# Altium schematic sheet B0621_T01_V1.0.SchDoc
size A2
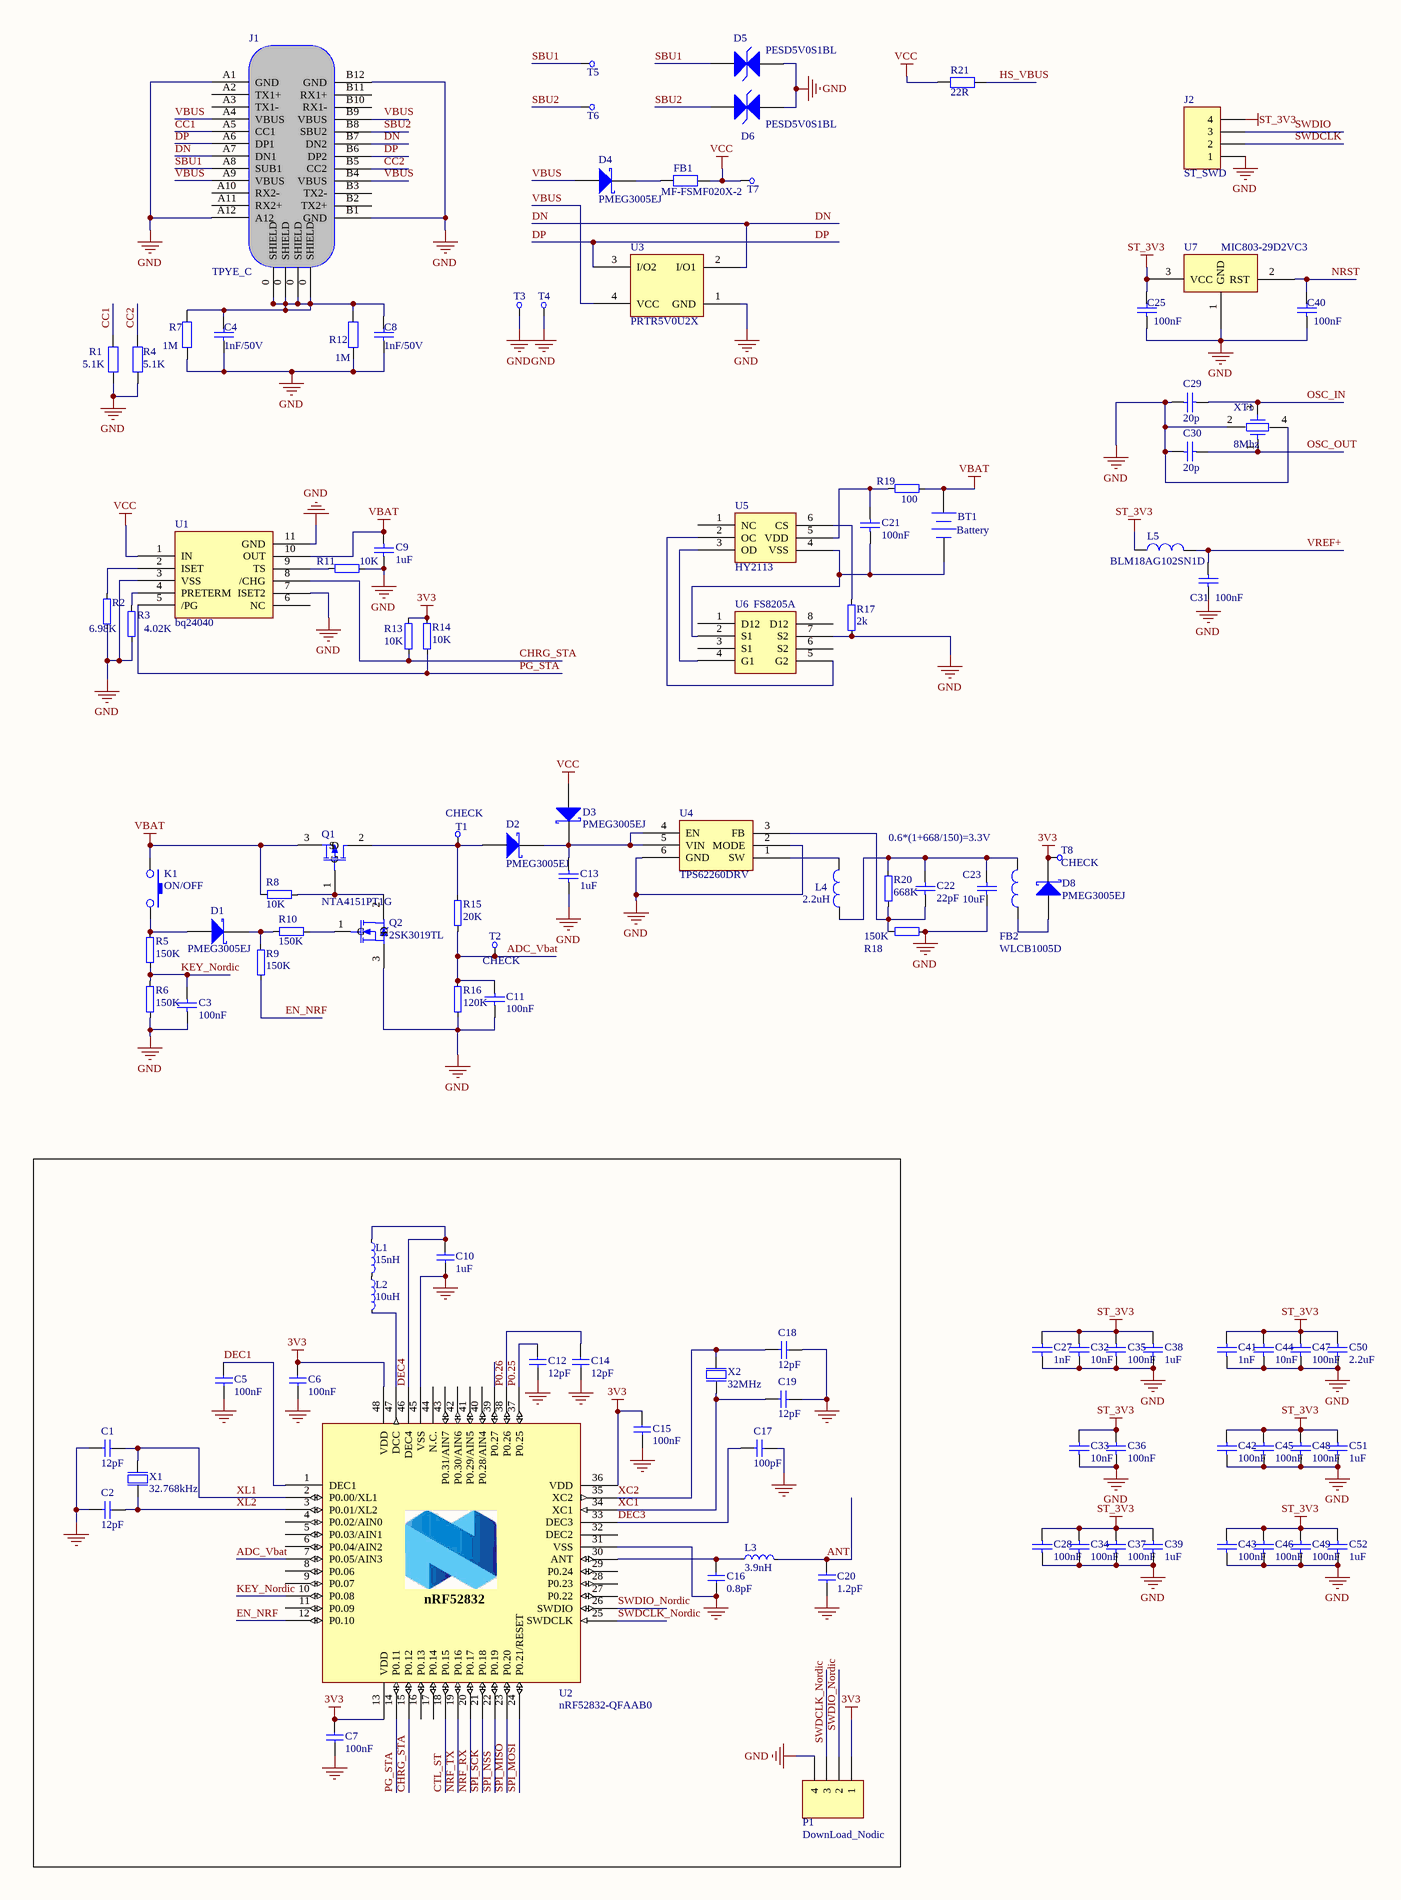
[diagram p0: B0621_T01_V1.0.SchDoc, left]
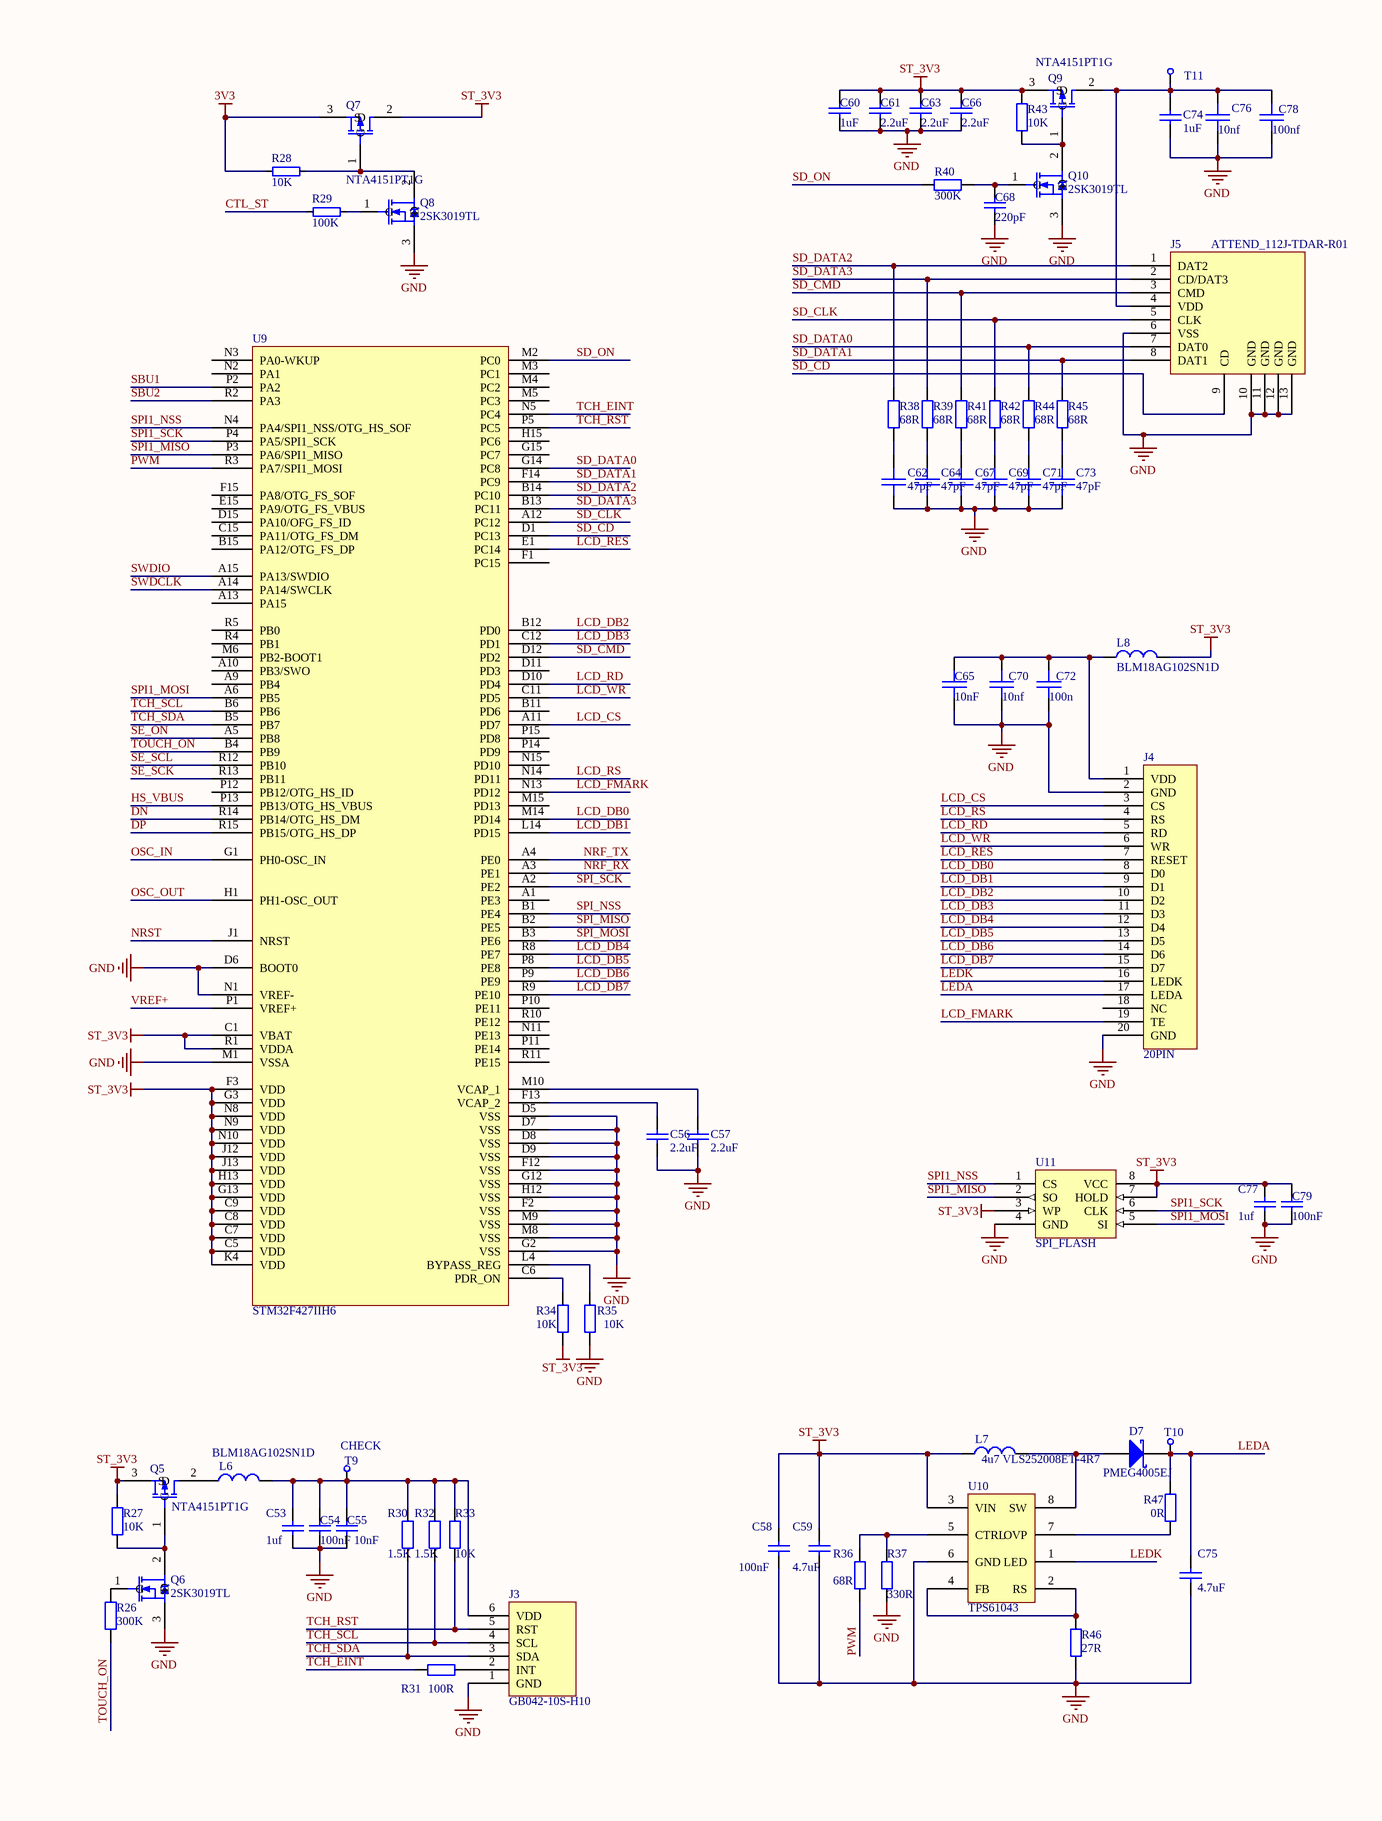
[diagram p1: B0621_T01_V1.0.SchDoc, right]

## Parts
BT1  Battery  [BAT_CON]
C1  12pF  [0402-c]
C2  12pF  [0402-c]
C3  100nF  [0402-c]
C4  1nF/50V  [0402-c]
C5  100nF  [0402-c]
C6  100nF  [0402-c]
C7  100nF  [0402-c]
C8  1nF/50V  [0402-c]
C9  1uF  [0402-c]
C10  1uF  [0402-c]
C11  100nF  [0402-c]
C12  12pF  [0402-c]
C13  1uF  [0402-c]
C14  12pF  [0402-c]
C15  100nF  [0402-c]
C16  0.8pF  [0402-c]
C17  100pF  [0402-c]
C18  12pF  [0402-c]
C19  12pF  [0402-c]
C20  1.2pF  [0402-c]
C21  100nF  [0402-c]
C22  22pF  [0402-c]
C23  10uF  [0402-C1]
C25  100nF  [0402-c]
C27  1nF  [0402-c]
C28  100nF  [0402-c]
C29  20p  [0402-c]
C30  20p  [0402-C]
C31  value 100nF  [0402-c]  (hidden comment: 100n)
C32  10nF  [0402-c]
C33  10nF  [0402-c]
C34  100nF  [0402-c]
C35  100nF  [0402-c]
C36  100nF  [0402-c]
C37  100nF  [0402-c]
C38  1uF  [0402-c]
C39  1uF  [0402-c]
C40  100nF  [0402-c]
C41  1nF  [0402-c]
C42  100nF  [0402-c]
C43  100nF  [0402-c]
C44  10nF  [0402-c]
C45  100nF  [0402-c]
C46  100nF  [0402-c]
C47  100nF  [0402-c]
C48  100nF  [0402-c]
C49  100nF  [0402-c]
C50  2.2uF  [0402-c]
C51  1uF  [0402-c]
C52  1uF  [0402-c]
C53  1uf  [0402-c]
C54  value 100nF  [0402-c]  (hidden comment: 1n)
C55  value 10nF  [0402-c]  (hidden comment: 1n)
C56  2.2uF  [0402-c]
C57  2.2uF  [0402-c]
C58  100nF  [0402-c]
C59  4.7uF  [0402-c]
C60  1uF  [0402-c]
C61  2.2uf  [0402-c]
C62  47pF  [0402-c]
C63  2.2uf  [0402-c]
C64  47pF  [0402-c]
C65  10nF  [0402-C]
C66  2.2uf  [0402-c]
C67  47pF  [0402-C]
C68  220pF  [0402-c]
C69  47pF  [0402-c]
C70  10nf  [0402-c]
C71  47pF  [0402-C]
C72  100n  [0402-c]
C73  47pF  [0402-C]
C74  1uF  [0402-c]
C75  4.7uF  [0402-c]
C76  10nf  [0402-c]
C77  1uf  [0402-c]
C78  100nf  [0402-c]
C79  value 100nF  [0402-c]  (hidden comment: 1n)
D1  PMEG3005EJ  [SOD323]
D2  PMEG3005EJ  [SOD323]
D3  PMEG3005EJ  [SOD323]
D4  PMEG3005EJ  [SOD323]
D5  PESD5V0S1BL  [SOD882]
D6  PESD5V0S1BL  [SOD882]
D7  PMEG4005EJ  [SOD323]
D8  PMEG3005EJ  [SOD323]
FB1  MF-FSMF020X-2  [0603-1]
FB2  WLCB1005D  [0603-1]
J1  TPYE_C  [TYPEC1]
J2  ST_SWD  [SWD_CON]
J3  GB042-10S-H10  [6PIN-1]
J4  20PIN  [20PIN-1]
J5  ATTEND_112J-TDAR-R01  [TF_1]
K1  ON/OFF  [switch_con]
L1  15nH  [INDC1005X04L]
L2  10uH  [INDC1005X04L]
L3  3.9nH  [INDC1005X04L]
L4  2.2uH  [0603-1]
L5  BLM18AG102SN1D  [0603-1]
L6  BLM18AG102SN1D  [0603-1]
L7  4u7 VLS252008ET-4R7  [L_2.5X2.0]
L8  BLM18AG102SN1D  [0603-1]
P1  DownLoad_Nodic  [SWD_CON]
Q1  NTA4151PT1G  [SOT523_MOSFET]
Q2  2SK3019TL  [SOT523_MOSFET]
Q5  NTA4151PT1G  [SOT523_MOSFET]
Q6  2SK3019TL  [SOT523_MOSFET]
Q7  NTA4151PT1G  [SOT523_MOSFET]
Q8  2SK3019TL  [SOT523_MOSFET]
Q9  NTA4151PT1G  [SOT523_MOSFET]
Q10  2SK3019TL  [SOT523_MOSFET]
R1  5.1K  [0402-a]
R2  6.98K  [0402-A]
R3  4.02K  [0402-A]
R4  5.1K  [0402-a]
R5  150K  [0402-A]
R6  150K  [0402-A]
R7  1M  [0402-a]
R8  10K  [0402-A]
R9  150K  [0402-A]
R10  150K  [0402-A]
R11  10K  [0402-A]
R12  1M  [0402-a]
R13  10K  [0402-A]
R14  10K  [0402-A]
R15  20K  [0402-A]
R16  120K  [0402-A]
R17  2k  [0402-A]
R18  150K  [0402-A]
R19  100  [0402-A]
R20  668K  [0402-A]
R21  22R  [0402-a]
R26  300K  [0402-A]
R27  10K  [0402-A]
R28  10K  [0402-A]
R29  100K  [0402-A]
R30  1.5K  [0402-A]
R31  100R  [0402-A]
R32  1.5K  [0402-A]
R33  10K  [0402-A]
R34  10K  [0402-A]
R35  10K  [0402-A]
R36  68R  [0402-a]
R37  330R  [0402-a]
R38  68R  [0402-A]
R39  68R  [0402-A]
R40  300K  [0402-A]
R41  68R  [0402-A]
R42  68R  [0402-A]
R43  10K  [0402-A]
R44  68R  [0402-A]
R45  68R  [0402-A]
R46  27R  [0402-a]
R47  0R  [0402-a]
T1  CHECK  [CHECK-B]
T2  CHECK  [CHECK-B]
T3  CHECK  [CHECK-B]  (value not drawn)
T4  CHECK  [CHECK-B]  (value not drawn)
T5  CHECK  [CHECK-B]  (value not drawn)
T6  CHECK  [CHECK-B]  (value not drawn)
T7  CHECK  [CHECK-B]  (value not drawn)
T8  CHECK  [CHECK-B]
T9  CHECK  [CHECK-B]
T10  CHECK  [CHECK-B]  (value not drawn)
T11  CHECK  [CHECK-B]  (value not drawn)
U1  bq24040  [WSON-10]
U2  nRF52832-QFAAB0  [2-QFN40P600X600X90-48N]
U3  PRTR5V0U2X  [SOT143B]
U4  TPS62260DRV  [SON-6]
U5  HY2113  [DFN-6L]
U6  FS8205A  [TSSOP-8]
U7  MIC803-29D2VC3  [SC70-3]
U9  STM32F427IIH6  [UFBGA176+25]
U10  TPS61043  [QFN-8]
U11  SPI_FLASH  [WSON-8]
X1  32.768kHz  [XTAL_3215]
X2  32MHz  [BT-XTAL_2016]
XT1  8Mhz  [OSC_4-3225]

## Nets
3V3: C6.2 C7.2 C15.2 D8.2(K) P1.1 Q7.3(S) R13.1 R14.1 R28.2 T8.1 U2.13(VDD) U2.36(VDD) U2.48(VDD)
GND: C1.2 C2.2 C3.1 C4.1 C5.1 C6.1 C7.1 C8.1 C9.1 C10.1 C11.1 C12.1 C13.1 C14.1 C15.1 C16.2 C17.1 C18.1 C19.2 C20.1 C23.2 C25.1 C27.2 C28.2 C29.2 C30.2 C31.1 C32.2 C33.2 C34.2 C35.2 C36.2 C37.2 C38.2 C39.2 C40.1 C41.2 C42.2 C43.2 C44.2 C45.2 C46.2 C47.2 C48.2 C49.2 C50.2 C51.2 C52.2 C53.1 C54.1 C55.1 C56.2 C57.2 C58.1 C59.1 C60.1 C61.1 C62.1 C63.1 C64.1 C65.2 C66.1 C67.1 C68.1 C69.1 C70.2 C71.1 C72.2 C73.1 C74.2 C75.1 C76.2 C77.1 C78.2 C79.1 D5.1(A) D6.1(A) J1.A1(GND) J1.A12 J1.B1(GND) J1.B12(GND) J2.1 J3.1(GND) J3.7 J3.8 J4.2(GND) J4.20(GND) J4.21 J4.22 J5.6(VSS) J5.10(GND) J5.11(GND) J5.12(GND) J5.13(GND) P1.4 Q2.3(S) Q6.3(S) Q8.3(S) Q10.3(S) R1.1 R2.1 R3.1 R4.1 R6.1 R7.1 R11.1 R12.1 R16.1 R17.2 R18.1 R35.1 R37.1 R46.1 T3.1 T4.1 U1.3(VSS) U1.7(ISET2) U1.11(GND) U2.31(VSS) U2.45(VSS) U2.49(GND) U3.1(GND) U4.2(MODE) U4.6(GND) U6.7(S2) U7.1(GND) U9.D5(VSS) U9.D6(BOOT0) U9.D7(VSS) U9.D8(VSS) U9.D9(VSS) U9.F2(VSS) U9.F6(GND) U9.F7(GND) U9.F8(GND) U9.F9(GND) U9.F10(GND) U9.F12(VSS) U9.G2(VSS) U9.G6(GND) U9.G7(GND) U9.G8(GND) U9.G9(GND) U9.G10(GND) U9.G12(VSS) U9.H6(GND) U9.H7(GND) U9.H8(GND) U9.H9(GND) U9.H10(GND) U9.H12(VSS) U9.J6(GND) U9.J7(GND) U9.J8(GND) U9.J9(GND) U9.J10(GND) U9.K6(GND) U9.K7(GND) U9.K8(GND) U9.K9(GND) U9.K10(GND) U9.M1(VSSA) U9.M8(VSS) U9.M9(VSS) U9.N1(VREF-) U10.6(GND) U10.9(GND) U11.4(GND) U11.9(GND) X2.2(GND) X2.4(GND) XT1.2 XT1.4
ST_3V3: C25.2 C27.1 C28.1 C32.1 C33.1 C34.1 C35.1 C36.1 C37.1 C38.1 C39.1 C41.1 C42.1 C43.1 C44.1 C45.1 C46.1 C47.1 C48.1 C49.1 C50.1 C51.1 C52.1 C58.2 C59.2 C60.2 C61.2 C63.2 C66.2 C77.2 C79.2 J2.4 L5.1 L7.1 L8.2 Q5.3(S) Q7.2(D) Q9.3(S) R27.2 R34.1 R43.2 U7.3(VCC) U9.C1(VBAT) U9.C5(VDD) U9.C7(VDD) U9.C8(VDD) U9.C9(VDD) U9.F3(VDD) U9.G3(VDD) U9.G13(VDD) U9.H13(VDD) U9.J12(VDD) U9.J13(VDD) U9.K4(VDD) U9.N8(VDD) U9.N9(VDD) U9.N10(VDD) U9.R1(VDDA) U10.3(VIN) U11.3(WP) U11.7(HOLD) U11.8(VCC)
VBAT: BT1.1(+) C9.2 K1.1 Q1.3(S) R8.2 R19.2 U1.10(OUT)
VCC: D3.1(A) FB1.2 R21.1 T7.1 U1.1(IN)
ADC_Vbat: C11.2 R15.2 R16.2 T2.1 U2.7(P0.05/AIN3)
ANT: C20.2 L3.2
CC1: J1.A5(CC1) R1.2
CC2: J1.B5(CC2) R4.2
CHRG_STA: R13.2 U1.8(/CHG) U2.15(P0.12)
CTL_ST: R29.2 U2.18(P0.15)
DEC1: C5.2 U2.1(DEC1)
DEC3: C17.2 U2.33(DEC3)
DEC4: C10.2 L1.1 U2.46(DEC4)
DN: J1.A7(DN1) J1.B7(DN2) U3.2(I/O1) U9.R14(PB14/OTG_HS_DM)
DP: J1.A6(DP1) J1.B6(DP2) U3.3(I/O2) U9.R15(PB15/OTG_HS_DP)
EN_NRF: R9.1 U2.12(P0.10)
HS_VBUS: R21.2 U9.P13(PB13/OTG_HS_VBUS)
KEY_Nordic: C3.2 R5.1 R6.2 U2.10(P0.08)
LCD_CS: J4.3(CS) U9.A11(PD7)
LCD_DB0: J4.8(D0) U9.M14(PD14)
LCD_DB1: J4.9(D1) U9.L14(PD15)
LCD_DB2: J4.10(D2) U9.B12(PD0)
LCD_DB3: J4.11(D3) U9.C12(PD1)
LCD_DB4: J4.12(D4) U9.R8(PE7)
LCD_DB5: J4.13(D5) U9.P8(PE8)
LCD_DB6: J4.14(D6) U9.P9(PE9)
LCD_DB7: J4.15(D7) U9.R9(PE10)
LCD_FMARK: J4.19(TE) U9.N13(PD12)
LCD_RD: J4.5(RD) U9.D10(PD4)
LCD_RES: J4.7(RESET) U9.E1(PC14)
LCD_RS: J4.4(RS) U9.N14(PD11)
LCD_WR: J4.6(WR) U9.C11(PD5)
LEDA: C75.2 D7.2(K) J4.17(LEDA) R47.2 T10.1
LEDK: J4.16(LEDK) U10.1(LED)
NRF_RX: U2.20(P0.17) U9.A3(PE1)
NRF_TX: U2.19(P0.16) U9.A4(PE0)
NRST: C40.2 U7.2(RST) U9.J1(NRST)
OSC_IN: C29.1 U9.G1(PH0-OSC_IN) XT1.3
OSC_OUT: C30.1 U9.H1(PH1-OSC_OUT) XT1.1
P0.25: C12.2 U2.37(P0.25)
P0.26: C14.2 U2.38(P0.26)
PG_STA: R14.2 U1.5(/PG) U2.14(P0.11)
PWM: R36.1 U9.R3(PA7/SPI1_MOSI)
SBU1: D5.2(K) J1.A8(SUB1) T5.1 U9.P2(PA2)
SBU2: D6.2(K) J1.B8(SBU2) T6.1 U9.R2(PA3)
SD_CD: J5.9(CD) U9.D1(PC13)
SD_CLK: J5.5(CLK) R42.1 U9.A12(PC12)
SD_CMD: J5.3(CMD) R41.1 U9.D12(PD2)
SD_DATA0: J5.7(DAT0) R44.1 U9.G14(PC8)
SD_DATA1: J5.8(DAT1) R45.1 U9.F14(PC9)
SD_DATA2: J5.1(DAT2) R38.1 U9.B14(PC10)
SD_DATA3: J5.2(CD/DAT3) R39.1 U9.B13(PC11)
SD_ON: R40.1 U9.M2(PC0)
SE_ON: U9.A5(PB8)
SE_SCK: U9.R13(PB11)
SE_SCL: U9.R12(PB10)
SPI1_MISO: U9.P3(PA6/SPI1_MISO) U11.2(SO)
SPI1_MOSI: U9.A6(PB5) U11.5(SI)
SPI1_NSS: U9.N4(PA4/SPI1_NSS/OTG_HS_SOF) U11.1(CS)
SPI1_SCK: U9.P4(PA5/SPI1_SCK) U11.6(CLK)
SPI_MISO: U2.23(P0.20) U9.B2(PE5)
SPI_MOSI: U2.24(P0.21/RESET) U9.B3(PE6)
SPI_NSS: U2.22(P0.19) U9.B1(PE4)
SPI_SCK: U2.21(P0.18) U9.A2(PE2)
SWDCLK: J2.2 U9.A14(PA14/SWCLK)
SWDCLK_Nordic: P1.3 U2.25(SWDCLK)
SWDIO: J2.3 U9.A15(PA13/SWDIO)
SWDIO_Nordic: P1.2 U2.26(SWDIO)
TCH_EINT: R31.2 U9.N5(PC4)
TCH_RST: J3.5(RST) R33.1 U9.P5(PC5)
TCH_SCL: J3.4(SCL) R32.1 U9.B6(PB6)
TCH_SDA: J3.3(SDA) R30.1 U9.B5(PB7)
TOUCH_ON: R26.1 U9.B4(PB9)
VBUS: D4.1(A) J1.A4(VBUS) J1.A9(VBUS) J1.B4(VBUS) J1.B9(VBUS) U3.4(VCC)
VREF+: C31.2 L5.2 U9.P1(VREF+)
XC1: C19.1 U2.34(XC1) X2.1(inp)
XC2: C18.2 U2.35(XC2) X2.3(out)
XL1: C1.1 U2.2(P0.00/XL1) X1.1(inp)
XL2: C2.1 U2.3(P0.01/XL2) X1.2(out)
NetBT1_2: BT1.2(-) C21.1 U5.4(VSS) U6.2(S1)
NetC4_2: C4.2 C8.2 J1.0(SHIELD) R7.2 R12.2
NetC13_2: C13.2 D2.2(K) D3.2(K) U4.4(EN) U4.5(VIN)
NetC16_1: C16.1 L3.1 U2.30(ANT)
NetC21_2: C21.2 R19.1 U5.5(VDD)
NetC22_1: C22.1 C23.1 FB2.2 L4.1 R20.1
NetC22_2: C22.2 R18.2 R20.2 U4.3(FB)
NetC53_2: C53.2 C54.2 C55.2 J3.6(VDD) L6.2 R30.2 R32.2 R33.2 T9.1
NetC56_1: C56.1 U9.F13(VCAP_2)
NetC57_1: C57.1 U9.M10(VCAP_1)
NetC62_2: C62.2 R38.2
NetC64_2: C64.2 R39.2
NetC65_1: C65.1 C70.1 C72.1 J4.1(VDD) L8.1
NetC67_2: C67.2 R41.2
NetC68_2: C68.2 Q10.1(G) R40.2
NetC69_2: C69.2 R42.2
NetC71_2: C71.2 R44.2
NetC73_2: C73.2 R45.2
NetC74_1: C74.1 C76.1 C78.1 J5.4(VDD) Q9.2(D) T11.1
NetD1_1: D1.1(A) K1.2 R5.2
NetD1_2: D1.2(K) R9.2 R10.2
NetD2_1: D2.1(A) Q1.2(D) R15.1 T1.1
NetD4_2: D4.2(K) FB1.1
NetD7_1: D7.1(A) L7.2 U10.8(SW)
NetD8_1: D8.1(A) FB2.1
NetJ3_2: J3.2(INT) R31.1
NetL1_2: L1.2 L2.1
NetL2_2: L2.2 U2.47(DCC)
NetL4_2: L4.2 U4.1(SW)
NetL6_1: L6.1 Q5.2(D)
NetQ1_1: Q1.1(G) Q2.2(D) R8.1
NetQ2_1: Q2.1(G) R10.1
NetQ5_1: Q5.1(G) Q6.2(D) R27.1
NetQ6_1: Q6.1(G) R26.2
NetQ7_1: Q7.1(G) Q8.2(D) R28.1
NetQ8_1: Q8.1(G) R29.1
NetQ9_1: Q9.1(G) Q10.2(D) R43.1
NetR2_2: R2.2 U1.2(ISET)
NetR3_2: R3.2 U1.4(PRETERM)
NetR11_2: R11.2 U1.9(TS)
NetR17_1: R17.1 U5.6(CS)
NetR34_2: R34.2 U9.C6(PDR_ON)
NetR35_2: R35.2 U9.L4(BYPASS_REG)
NetR36_2: R36.2 R37.2 U10.5(CTRL)
NetR46_2: R46.2 U10.2(RS) U10.4(FB)
NetR47_1: R47.1 U10.7(OVP)
NetU5_2: U5.2(OC) U6.5(G2)
NetU5_3: U5.3(OD) U6.4(G1)

Not connected (* = marked no-connect by the designer): J1 A2(TX1+) A3(TX1-) A10(RX2-) A11(RX2+) B2(TX2+) B3(TX2-) B10(RX1-) B11(RX1+); J4 18(NC); U1 6(NC); U2 4(P0.02/AIN0) 5(P0.03/AIN1) 6(P0.04/AIN2) 8(P0.06) 9(P0.07) 11(P0.09) 16(P0.13) 17(P0.14) 27(P0.22) 28(P0.23) 29(P0.24) 32(DEC2) 39(P0.27) 40(P0.28/AIN4) 41(P0.29/AIN5) 42(P0.30/AIN6) 43(P0.31/AIN7) 44(N.C.); U5 1(NC); U6 1(D12) 3(S1) 6(S2) 8(D12); U9 A1(PE3) A7(PG14) A8(PG13) A9(PB4) A10(PB3/SWO) A13(PA15) B7(PG15) B8(PG12) B9(PG11) B10(PG10) B11(PD6) B15(PA12/OTG_FS_DP) C2(PI7) C3(PI6) C4(PI5) C10(PG9) C13(PI3) C14(PI2) C15(PA11/OTG_FS_DM) D2(PI8) D3(PI9) D4(PI4) D11(PD3) D13(PH15) D14(PI1) D15(PA10/OFG_FS_ID) E2(PF0) E3(PI10) E4(PI11) E12(PH13) E13(PH14) E14(PI0) E15(PA9/OTG_FS_VBUS) F1(PC15) F4(PH2) F15(PA8/OTG_FS_SOF) G4(PH3) G15(PC7) H2(PF2) H3(PF1) H4(PH4) H14(PG8) H15(PC6) J2(PF3) J3(PF4) J4(PH5) J14(PG7) J15(PG6) K1(PF7) K2(PF6) K3(PF5) K12(PH12) K13(PG5) K14(PG4) K15(PG3) L1(PF10) L2(PF9) L3(PF8) L12(PH11) L13(PH10) L15(PG2) M3(PC1) M4(PC2) M5(PC3) M6(PB2-BOOT1) M7(PG1) M11(PH6) M12(PH8) M13(PH9) M15(PD13) N2(PA1) N3(PA0-WKUP) N6(PF13) N7(PG0) N11(PE13) N12(PH7) N15(PD10) P6(PF12) P7(PF15) P10(PE11) P11(PE14) P12(PB12/OTG_HS_ID) P14(PD9) P15(PD8) R4(PB1) R5(PB0) R6(PF11) R7(PF14) R10(PE12) R11(PE15)

## Notes on the sheet
- 0.6*(1+668/150)=3.3V
- (in symbol nRF52832-QFAAB0) nRF52832

## Library data of the parts
BT1 = Battery: 备份电池; Published: 24-Mar-1999; LatestRevisionDate: 17-Jul-2002; LatestRevisionNote: Re-released for DXP Platform.; PackageReference: BAT-2; Publisher: Altium Limited
C1 C2 C12 C14 C18 C19 = C0402-12p: Capacitor, NP0, ?%; Part number IPS: 00000002398; Note: 50V; Artikkelnr Noca: 20029159; Artikkelnr Simpro: N.A.; Part Number: C0402-12p; Manufacturer: *; Manufacturer Part Number: *; Datasheet: *; LatestRevisionDate: 2011-05-11; Pin Count: 2; Publisher: Nordic Semiconductor; Published: 2009-05-08; Value: 12pF; Supplier: *; Supplier part number: *; 2nd source Supplier: *; 2nd source part number: *; Footprint Doc: 0402
C3 C4 C8 C9 C11 C13 C21-C23 C25 C27-C61 C63 C66 C68 C74 C75 C77 C79 = Cap: 无极性电容; Published: 8-Jun-2000; LatestRevisionDate: 17-Jul-2002; LatestRevisionNote: Re-released for DXP Platform.; PackageReference: RAD-0.3; Publisher: Altium Limited
  C3 C11 C21 C25 C28 C34-C37 C40 C42 C43 C45-C49 C58: Value: 100nF
  C4 C8: Value: 1nF/50V
  C9 C38 C39 C51 C52 C60 C74: Value: 1uF
  C22: Value: 22pF
  C23: Value: 10uF
  C27 C41: Value: 1nF
  C29 C30: Value: 20p
  C32 C33 C44: Value: 10nF
  C50 C56 C57 C61 C63 C66: Value: 2.2uF
  C53 C77: Value: 1uf
  C59 C75: Value: 4.7uF
  C68: Value: 220pF
C5 C7 C15 = C0402-100n: Capacitor, X7R, ?0%; Part number IPS: 00000005296; Note: 16V; Artikkelnr Noca: 20039200; Artikkelnr Simpro: N.A.; Part Number: C0402-100n; Manufacturer: *; Manufacturer Part Number: *; Datasheet: *; LatestRevisionDate: 2009-11-23; Pin Count: 2; Publisher: Nordic Semiconductor; Published: 2009-05-08; Value: 100nF; Supplier: *; Supplier part number: *; 2nd source Supplier: *; 2nd source part number: *; Footprint Doc: 0402
C6 = C0603-4?: Capacitor, X5R, ?0%; Part number IPS: 00000003141; Note: 6.3V; Artikkelnr Noca: 20069060; Artikkelnr Simpro: N.A.; Part Number: C0603-4?; Manufacturer: *; Manufacturer Part Number: *; Datasheet: *; LatestRevisionDate: 2009-11-23; Pin Count: 2; Publisher: Nordic Semiconductor; Published: 2009-05-08; Value: 100nF; Supplier: *; Supplier part number: *; 2nd source Supplier: *; 2nd source part number: *; Footprint Doc: 0603
C10 = C0603-1?: Capacitor, X7R, ?0%; Part number IPS: 00000000616; Value: 1.0uF; Note: 16V; Artikkelnr Noca: 20039335; Artikkelnr Simpro: N.A.; Part Number: C0603-1?; Manufacturer: *; Manufacturer Part Number: *; Datasheet: *; LatestRevisionDate: 2013-06-05; Pin Count: 2; Publisher: Nordic Semiconductor; Published: 2009-05-08; Supplier: *; Supplier part number: *; 2nd source Supplier: *; 2nd source part number: *; Footprint Doc: 0603
C16 = C0402-0.8p: Capacitor, NP0, ?%; Note: 50V; Artikkelnr Noca: 20029147; Artikkelnr Simpro: N.A.; Part Number: C0402-0.8p; Manufacturer: *; Manufacturer Part Number: *; Datasheet: *; LatestRevisionDate: 2012-11-21; Pin Count: 2; Publisher: Nordic Semiconductor; Published: 2009-05-08; Value: 0.8pF; Supplier: *; Supplier part number: *; 2nd source Supplier: *; 2nd source part number: *; Footprint Doc: 0402
C17 = C0402-100p: Capacitor, NP0, ?%; Part number IPS: 00000002361; Note: 50V; Artikkelnr Noca: 20029135; Artikkelnr Simpro: N.A.; Part Number: C0402-100p; Manufacturer: *; Manufacturer Part Number: *; Datasheet: *; LatestRevisionDate: 2009-05-08; Pin Count: 2; Publisher: Nordic Semiconductor; Published: 2009-05-08; Value: 100pF; Supplier: *; Supplier part number: *; 2nd source Supplier: *; 2nd source part number: *; Footprint Doc: 0402
C20 = C0402-1.2p: Capacitor, NP0, ?.1pF; Part number IPS: 00000005410; Note: 50V; Artikkelnr Noca: 20029157; Artikkelnr Simpro: N.A.; Part Number: C0402-1.2p; Manufacturer: *; Manufacturer Part Number: *; Datasheet: *; LatestRevisionDate: 2011-05-11; Pin Count: 2; Publisher: Nordic Semiconductor; Published: 2009-05-08; Value: 1.2pF; Supplier: *; Supplier part number: *; 2nd source Supplier: *; 2nd source part number: *; Footprint Doc: 0402
C62 C64 C65 C67 C69-C73 C76 C78 = SMT_C_0402: Surface mount capacitor 0402
D1-D4 D7 D8 = D-Schottky: 肖特基二极管; Published: 8-Jun-2000; LatestRevisionDate: 17-Jul-2002; LatestRevisionNote: Re-released for DXP Platform.; PackageReference: SMB; Publisher: Altium Limited; Code_JEDEC: DO-214-AA
  D1-D4 D8: Type: PMEG3005EJ
  D7: Type: PMEG4005EJ
D5 D6 = TVS_DIOCODE: TVS
FB1 R1 R4 R7 R12 R21 R26 R27 R30-R47 = Res1: 贴片电阻; Published: 8-Jun-2000; LatestRevisionDate: 17-Jul-2002; LatestRevisionNote: Re-released for DXP Platform.; PackageReference: AXIAL-0.4; Publisher: Altium Limited
  FB1: Value: MF-FSMF020X-2
  R1 R4: Value: 5.1K
  R7 R12: Value: 1M
  R21: Value: 22R
  R26 R40: Value: 300K
  R27 R33-R35 R43: Value: 10K
  R30 R32: Value: 1.5K
  R31: Value: 100R
  R36 R38 R39 R41 R42 R44 R45: Value: 68R
  R37: Value: 330R
  R46: Value: 27R
  R47: Value: 0R
FB2 = Inductor: magnetic bead; Code_IEC: 1005; Published: 8-Jun-2000; LatestRevisionDate: 17-Jul-2002; LatestRevisionNote: Re-released for DXP Platform.; PackageReference: 0402-A; Publisher: Altium Limited; Code_JEITA: 0402; Value: WLCB1005D
J1 = TPYE_C: USB
J2 P1 = Header 4: Header, 4-Pin; LatestRevisionDate: 17-Jul-2002; LatestRevisionNote: Re-released for DXP Platform.; Publisher: Altium Limited
J3 = GB042-10S--H10: Touch
J5 = ATTEND_112J-TDAR-R01: MICRO_SD
K1 = KEY
L1 = L0402-15n: Inductor, 320mA, ?%; Manufacturer: Taiyo Yuden; Manufacturer Part Number: HK100515NJ-T; 2nd source part number: 658-1328; Note: High frequency chip inductor ?0%; Artikkelnr Noca: 33029323; Artikkelnr Simpro: N.A.; Part Number: L0402-15n; LatestRevisionDate: 2012-09-19; Pin Count: 2; Publisher: Nordic Semiconductor; Published: 2010-07-12; Value: 15nH; Supplier: Digi-Key; Datasheet: http://www.yuden.co.jp/productdata/catalog/en/mlci04_e.pdf; Supplier part number: 587-1521-1-ND; 2nd source Supplier: Farnell; Footprint Doc: 0402; ComponentLink1Description: Datasheet; ComponentLink2Description: Supplier link
L2 = L0603-10?: Inductor, 80mA, ?0%; Manufacturer: Taiyo Yuden; Manufacturer Part Number: LBMF1608T100K; 2nd source part number: 178-6105; Note: LBMF1608T100K 10µH 80mA 0603; Artikkelnr Noca: 33029314; Artikkelnr Simpro: N.A.; Part Number: L0603-10?; Datasheet: http://www.yuden.co.jp/ut/product/pdf/elb2_e.pdf; LatestRevisionDate: 2012-09-19; Pin Count: 2; Publisher: Nordic Semiconductor; Published: 2010-02-24; Value: 10uH; Supplier: Digi-Key; Supplier part number: 587-1714-1-ND; 2nd source Supplier: Farnell; Footprint Doc: 0603; ComponentLink1Description: Datasheet; ComponentLink2Description: Supplier link
L3 = L0402-3n9: Inductor, 170mA, ?.1nH; Manufacturer: Murata; Manufacturer Part Number: LQP15MN3N9B02D; Note: High frequency chip inductor ?%; Artikkelnr Noca: 33029151; Artikkelnr Simpro: N.A.; Part Number: L0402-3n9; Datasheet: http://search.murata.co.jp/Ceramy/image/img/PDF/ENG/L0075S0084LQP15M.pdf; LatestRevisionDate: 2012-09-19; Pin Count: 2; Publisher: Nordic Semiconductor; Published: 2009-05-08; Value: 3.9nH; Supplier: Digi-Key; Supplier part number: 490-1131-1-ND; 2nd source Supplier: *; 2nd source part number: *; Footprint Doc: 0402; ComponentLink1Description: Datasheet; ComponentLink2Description: Supplier link
L4 = Inductor: inductance; Code_IEC: 1005; Published: 8-Jun-2000; LatestRevisionDate: 17-Jul-2002; LatestRevisionNote: Re-released for DXP Platform.; PackageReference: 0402-A; Publisher: Altium Limited; Code_JEITA: 0402; Value: 2.2uH
L5-L8 = Inductor: 电感; Code_IEC: 1005; Published: 8-Jun-2000; LatestRevisionDate: 17-Jul-2002; LatestRevisionNote: Re-released for DXP Platform.; PackageReference: 0402-A; Publisher: Altium Limited; Code_JEITA: 0402
  L5 L6 L8: Value: BLM18AG102SN1D
  L7: Value: 4u7 VLS252008ET-4R7
Q1 Q5 Q7 Q9 = MOSFET-P: P-Channel MOSFET; PackageDocument: 1995/1996; Published: 8-Jun-2000; LatestRevisionDate: 17-Jul-2002; LatestRevisionNote: Re-released for DXP Platform.; PackageReference: E3; Publisher: Altium Limited
Q2 Q6 Q8 Q10 = MOSFET-N: N-Channel MOSFET; PackageDocument: 1995/1996; Published: 8-Jun-2000; LatestRevisionDate: 17-Jul-2002; LatestRevisionNote: Re-released for DXP Platform.; PackageReference: E3; Publisher: Altium Limited
R2 R3 R5 R6 R8-R11 R13-R20 R28 R29 = R-10K: resistor
T1-T11 = CHECK: 测试点
U1 = bq24040: Charge
U2 = nRF52832-QFAAB0: Multi-protocol Bluetooth Low Energy, ANT and 2.4GHz proprietary system-on-chip; Manufacturer: Nordic Semiconductor; Artikkelnr Noca: 15079334; Artikkelnr Simpro: N.A.; Part Number: nRF52832-QFAAB0; Manufacturer Part Number: nRF52832-QFAAB0; Datasheet: *; LatestRevisionDate: 2016-08-25; Pin Count: 48; Publisher: Nordic Semiconductor; Published: 2016-08-25; Value: nRF52832-QFAAB0; Note: *; Supplier: Nordic Semiconductor; Supplier part number: nRF52832-QFAAB0; 2nd source Supplier: *; 2nd source part number: *; Footprint Doc: QFN-48
U3 = PRTR5V0U2X: ESD_Protect
U5 = HY2113: Charger
U6 = FS8205A: Charger IC
U7 = MIC803
U10 = TPS61043: Led Drvier
X1 = XTAL_FC-135 32.768k: XTAL SMD 3215, 32.768kHz, 9pF, ?0ppm; Manufacturer: Epson Toyocom; Manufacturer Part Number: FC-135 32.768KHZ ?0PPM,9.0PF; 2nd source part number: 127-8037; Note: XTAL SMD 32.768kHz, 3215; Artikkelnr Noca: 22019091; Artikkelnr Simpro: N.A.; Part Number: XTAL_FC-135 32.768k; Datasheet: http://www.farnell.com/datasheets/57480.pdf; LatestRevisionDate: 2014-03-27; Pin Count: 2; Publisher: Nordic Semiconductor; Published: 2010-10-18; Value: 32.768kHz; Supplier: Digi-Key; Supplier part number: FC-135 32.7680KA-AC-ND; 2nd source Supplier: Farnell; Footprint Doc: XTAL_3215
X2 = XTAL_SMD2016_32MHz_8pF_Epson: XTAL SMD 2016, 32MHz, Cl=8pF, Tol: ?0ppm, Stab: ?0ppm; Manufacturer: Epson Toyocom; Manufacturer Part Number: Q22FA12800025; Note: XTAL SMD 32.000MHz; Artikkelnr Noca: 22019238; Artikkelnr Simpro: N.A.; Part Number: XTAL_SMD2016_32MHz_8pF_Epson; Datasheet: http://www.epsondevice.com/docs/qd/en/DownloadServlet?id=ID000449; LatestRevisionDate: 2014-11-27; Pin Count: 4; Publisher: Nordic Semiconductor; Published: 2012-03-09; Value: 32MHz; Supplier: Farnell; Supplier part number: 171-2806; 2nd source Supplier: *; 2nd source part number: *; Footprint Doc: XTAL_2016
XT1 = XT: 晶振